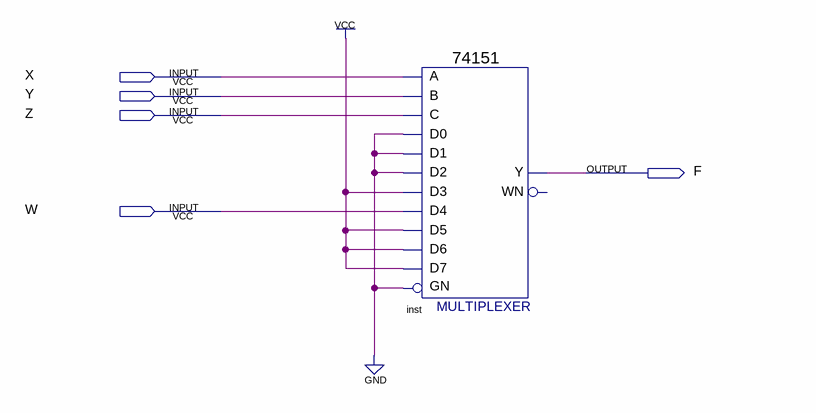
[diagram p0: schematic sheet]
// Quartus schematic Question2p2.bdf as structural Verilog: 1 symbols, 5 pins
module Question2p2 (
  input  X,
  input  Y,
  input  Z,
  input  W,
  output F
);

  \74151  inst (
    .GN(1'b0), .C(Z), .B(Y), .A(X), .D5(1'b1), .D0(1'b0), .D1(1'b0), .D4(W), .D3(1'b1), .D2(1'b0), .D6(1'b1),
    .D7(1'b1), .Y(F));  // open: WN
endmodule
